# EAGLE design pcb v1 mod (EAGLE 7.3.0)
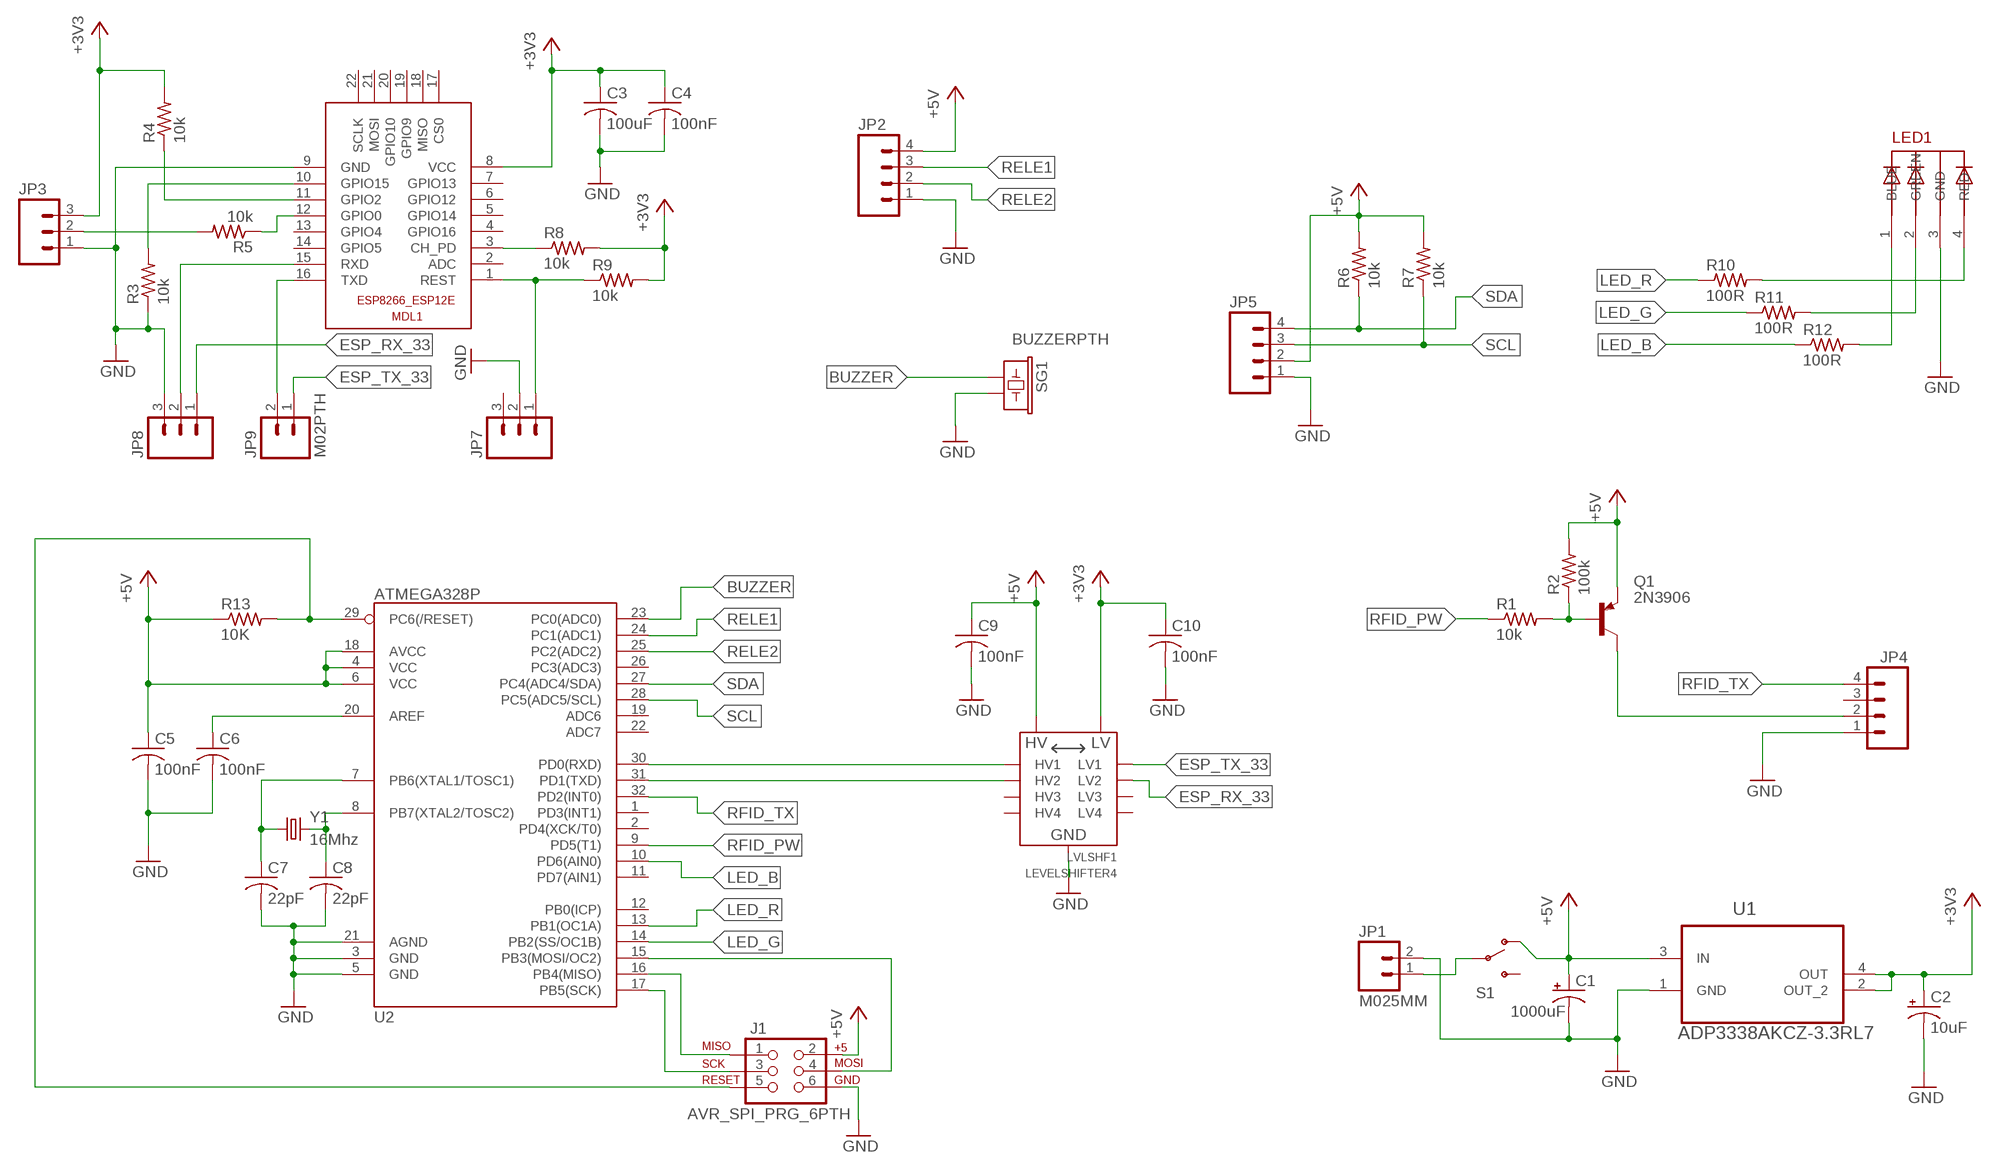
[diagram p0: schematic, sheet 1]

## Parts
C1  1000uF  CPOL-USE2.5-6  [E2,5-6]
C2  10uF  CPOL-USE2.5-6  [E2,5-6]
C3  100uF  C-USC1206  [C1206]
C4  100nF  C-USC0805  [C0805]
C5  100nF  C-USC0805  [C0805]
C6  100nF  C-USC0805  [C0805]
C7  22pF  C-USC1206  [C1206]
C8  22pF  C-USC1206  [C1206]
C9  100nF  C-USC0805  [C0805]
C10  100nF  C-USC0805  [C0805]
J1  AVR_SPI_PRG_6PTH  [2X3]
JP1  M025MM  [SCREWTERMINAL-5MM-2]
JP2  M041X04_NO_SILK  [1X04_NO_SILK]
JP3  M03PTH  [1X03]
JP4  M041X04_NO_SILK  [1X04_NO_SILK]
JP5  M041X04_NO_SILK  [1X04_NO_SILK]
JP7  M03PTH  [1X03]
JP8  M03PTH  [1X03]
JP9  M02PTH  [1X02]
LED1  5MMRGBLED  [LED5MMRGB]
LVLSHF1  LEVELSHIFTER4  [LEVELSHIFTER4]
MDL1  ESP8266-12EESP8266-ESP12E  [ESP8266-ESP12E]
Q1  2N3906  [TO92]
R1  10k  R-US_R0805  [R0805]
R2  100k  R-US_R0805  [R0805]
R3  10k  R-US_R0805  [R0805]
R4  10k  R-US_R0805  [R0805]
R5  10k  R-US_R0805  [R0805]
R6  10k  R-US_R0805  [R0805]
R7  10k  R-US_R0805  [R0805]
R8  10k  R-US_R0805  [R0805]
R9  10k  R-US_R0805  [R0805]
R10  100R  R-US_R1206  [R1206]
R11  100R  R-US_R0805  [R0805]
R12  100R  R-US_R0805  [R0805]
R13  10K  R-US_R0805  [R0805]
S1  SWITCH-SPDTPTH  [SWITCH-SPDT]
SG1  BUZZERPTH  [BUZZER-12MM]
U1  ADP3338AKCZ-3.3RL7  [SOT230P700X180-4N]
U2  ATMEGA328P  ATMEGA328_SMT  [TQFP32-08]
Y1  16Mhz  CRYSTALHC49US  [HC49US]

## Nets
+3V3: C2.+ C3.1 C4.1 C10.1 JP3.3 LVLSHF1.LV MDL1.8(VCC) R4.2 R8.2 R9.2 U1.2(OUT_2) U1.4(OUT)
+5V: C1.+ C5.1 C9.1 J1.2 JP2.4 JP5.2 LVLSHF1.HV Q1.3(E) R2.2 R6.2 R7.2 R13.1 S1.1(O) U1.3(IN) U2.4(VCC) U2.6(VCC) U2.18(AVCC)
AT_RST: J1.5 R13.2 U2.29(PC6(/RESET))
BUZZER: SG1.+ U2.23(PC0(ADC0))
ESP_RX_33: JP8.1 LVLSHF1.LV2
ESP_TX_33: JP9.1 LVLSHF1.LV1
GND: C1.- C2.- C3.2 C4.2 C5.2 C6.2 C7.2 C8.2 C9.2 C10.2 J1.6 JP1.2 JP2.1 JP3.1 JP4.1 JP5.1 JP7.2 JP8.3 LED1.3(GND) LVLSHF1.GND LVLSHF1.GND1(GND) MDL1.9(GND) R3.1 SG1.- U1.1(GND) U2.3(GND) U2.5(GND) U2.21(AGND)
LED_B: R12.1 U2.10(PD6(AIN0))
LED_G: R11.1 U2.14(PB2(SS/OC1B))
LED_R: R10.1 U2.13(PB1(OC1A))
N$1: JP1.1 S1.2(P)
N$2: MDL1.3(CH_PD) R8.1
N$3: MDL1.11(GPIO2) R4.1
N$4: MDL1.12(GPIO0) R5.1
N$5: MDL1.10(GPIO15) R3.2
N$6: JP8.2 MDL1.15(RXD)
N$7: Q1.2(B) R1.2 R2.1
N$8: JP9.2 MDL1.16(TXD)
N$9: JP7.1 MDL1.1(REST) R9.1
N$10: LED1.4(RED) R10.2
N$11: C7.1 U2.7(PB6(XTAL1/TOSC1)) Y1.1
N$12: C8.1 U2.8(PB7(XTAL2/TOSC2)) Y1.2
N$14: C6.1 U2.20(AREF)
N$15: LED1.2(GREEN) R11.2
N$16: LED1.1(BLUE) R12.2
N$17: J1.3 U2.17(PB5(SCK))
N$18: J1.1 U2.16(PB4(MISO))
N$19: J1.4 U2.15(PB3(MOSI/OC2))
N$20: JP3.2 R5.2
N$21: LVLSHF1.HV1 U2.30(PD0(RXD))
N$22: LVLSHF1.HV2 U2.31(PD1(TXD))
N$23: JP4.2 Q1.1(C)
RELE1: JP2.3 U2.24(PC1(ADC1))
RELE2: JP2.2 U2.25(PC2(ADC2))
RFID_PW: R1.1 U2.9(PD5(T1))
RFID_TX: JP4.4 U2.32(PD2(INT0))
SCL: JP5.3 R7.1 U2.28(PC5(ADC5/SCL))
SDA: JP5.4 R6.1 U2.27(PC4(ADC4/SDA))
Unconnected: JP4.3 JP7.3 LVLSHF1.HV3 LVLSHF1.HV4 LVLSHF1.LV3 LVLSHF1.LV4 MDL1.2(ADC) MDL1.4(GPIO16) MDL1.5(GPIO14) MDL1.6(GPIO12) MDL1.7(GPIO13) MDL1.13(GPIO4) MDL1.14(GPIO5) MDL1.17(CS0) MDL1.18(MISO) MDL1.19(GPIO9) MDL1.20(GPIO10) MDL1.21(MOSI) MDL1.22(SCLK) S1.3(S) U2.1(PD3(INT1)) U2.2(PD4(XCK/T0)) U2.11(PD7(AIN1)) U2.12(PB0(ICP)) U2.19(ADC6) U2.22(ADC7) U2.26(PC3(ADC3))

## Library data of the parts
C1 C2 = rcl:CPOL-US: POLARIZED CAPACITOR, American symbol
C3-C10 = rcl:C-US: CAPACITOR, American symbol
J1 = SparkFun-Connectors:AVR_SPI_PRG_6: AVR ISP 6 Pin This is the reduced ISP connector for AVR programming. Common on Arduino. This footprint will take up less PCB space and can be used with a 10-pin to 6-pin adapter such as SKU: BOB-08508 **Special note about "TEST_POINT" package. The stop mask is on the top side, so if you want your programming test points to be on the bottom of your board, make sure to place this package on the bottom side of the board. This also ensure that the orientation to program from the bottom side will be correct.
JP1 = SparkFun-Connectors:M02: Standard 2-pin 0.1" header. Use with - straight break away headers ( PRT-00116) - right angle break away headers (PRT-00553) - swiss pins (PRT-00743) - machine pins (PRT-00117) - female headers (PRT-00115) Molex polarized connector foot print use with: PRT-08233 with associated crimp pins and housings. 2.54_SCREWTERM for use with PRT-10571. 3.5mm Screw Terminal footprints for PRT-08084 5mm Screw Terminal footprints for use with PRT-08432; STOREFRONT_ID: PRT-08432
JP2 JP4 JP5 = SparkFun-Connectors:M04: Header 4 Standard 4-pin 0.1" header. Use with straight break away headers (SKU : PRT-00116), right angle break away headers (PRT-00553), swiss pins (PRT-00743), machine pins (PRT-00117), and female headers (PRT-00115). Molex polarized connector foot print use with SKU : PRT-08231 with associated crimp pins and housings. 1MM SMD Version SKU: PRT-10208
JP3 JP7 JP8 = SparkFun-Connectors:M03: Header 3 Standard 3-pin 0.1" header. Use with straight break away headers (SKU : PRT-00116), right angle break away headers (PRT-00553), swiss pins (PRT-00743), machine pins (PRT-00117), and female headers (PRT-00115). Molex polarized connector foot print use with SKU : PRT-08232 with associated crimp pins and housings.
JP9 = SparkFun-Connectors:M02: Standard 2-pin 0.1" header. Use with - straight break away headers ( PRT-00116) - right angle break away headers (PRT-00553) - swiss pins (PRT-00743) - machine pins (PRT-00117) - female headers (PRT-00115) Molex polarized connector foot print use with: PRT-08233 with associated crimp pins and housings. 2.54_SCREWTERM for use with PRT-10571. 3.5mm Screw Terminal footprints for PRT-08084 5mm Screw Terminal footprints for use with PRT-08432
LED1 = adafruit:5MMRGBLED
LVLSHF1 = partes:LEVELSHIFTER4
MDL1 = ESP8266-ESP12E:ESP8266-12E: ESP8266-12E with additional I/O and GPIO04/05 corrected The author cannot warrant that this library is free from error or will meet your specific requirements. Created by PuceBaboon.com. Komagane, Nagano, JAPAN
Q1 = transistor-pnp:2N3906: PNP Transistor
R1-R13 = rcl:R-US_: RESISTOR, American symbol
S1 = SparkFun-Electromechanical:SWITCH-SPDT: SPDT Switch Simple slide switch, Spark Fun Electronics SKU : COM-00102 DPDT SMT slide switch, AYZ0202, SWCH-08179; PROD_ID: SWCH-08261
SG1 = SparkFun-Electromechanical:BUZZER: Buzzer 12mm Spark Fun Electronics SKU : Comp-Buzzer
U1 = ADI-Phase-2:ADP3338AKCZ-3.3RL7: Low Dropout Regulator; MPN: ADP3338AKCZ-3.3RL7; OC_FARNELL: 1319313; OC_NEWARK: 19M8720; PACKAGE: SOT-223-3; SUPPLIER: Analog Devices
U2 = SparkFun-DigitalIC:ATMEGA328_SMT: 32-Pin Atmega328 part Commonly used on Arduino compatible boards Available in QFP and QFN packages TQFP is IC-09069 QFN is non-stock; PROD_ID: IC-09069
Y1 = SparkFun-FreqCtrl:CRYSTAL: Various standard crystals. Proven footprints. Spark Fun Electronics SKU : COM-00534

## Board
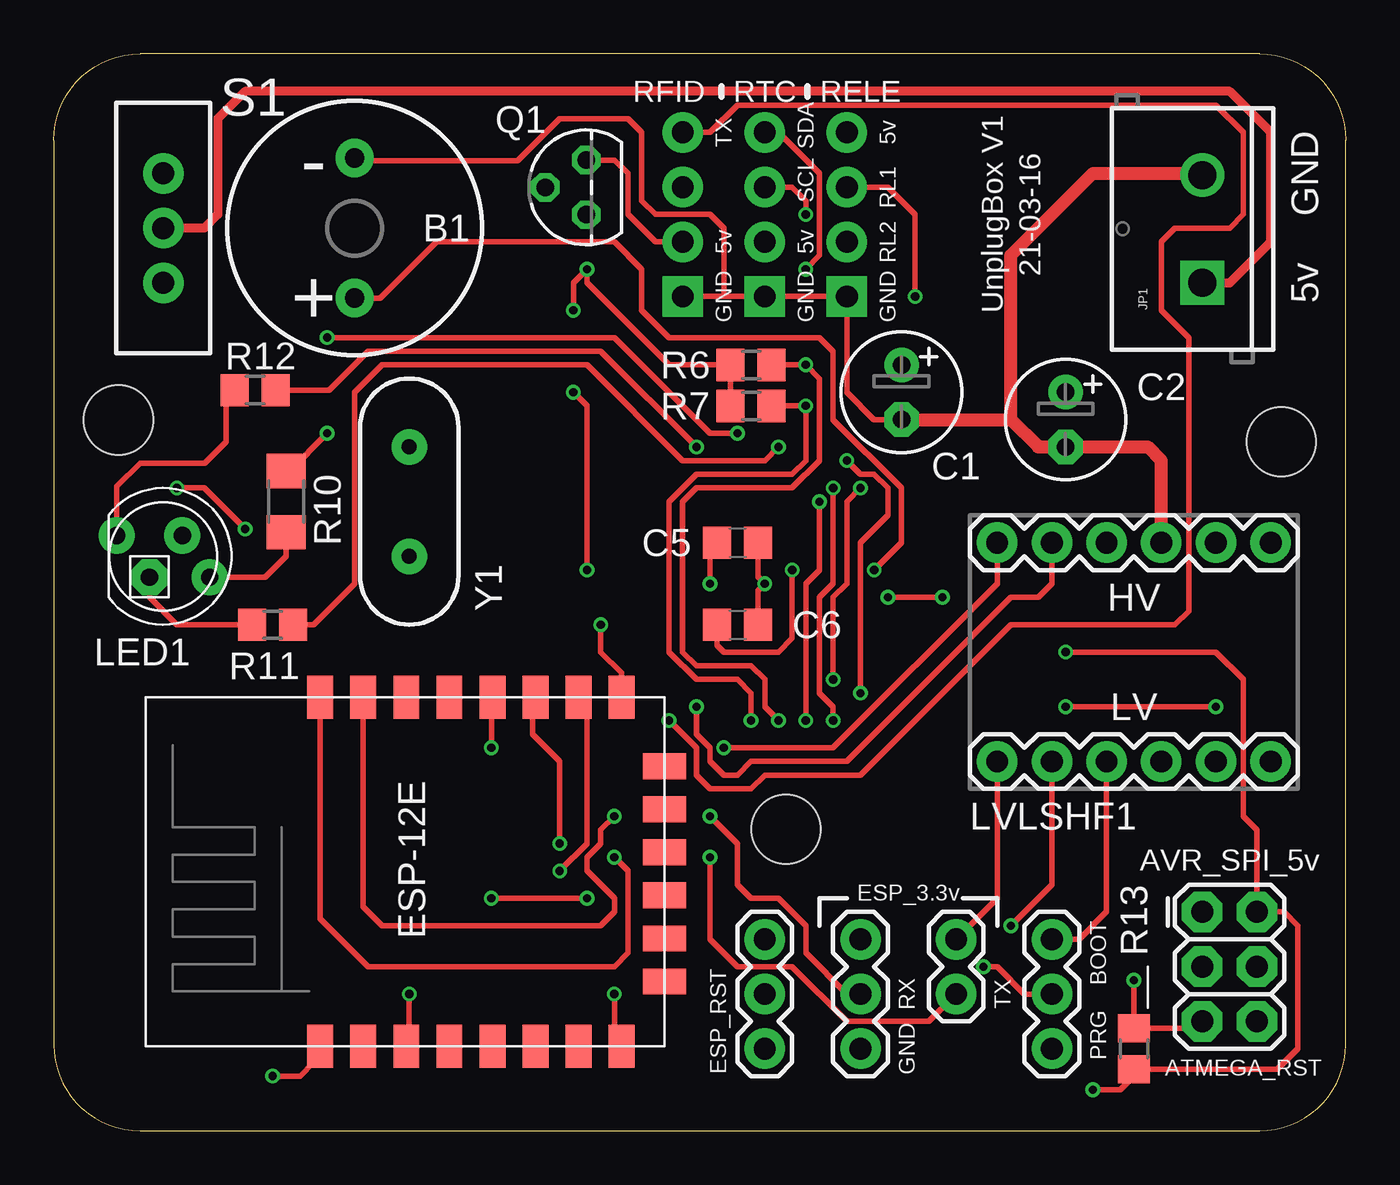
[diagram p1: board, top side]
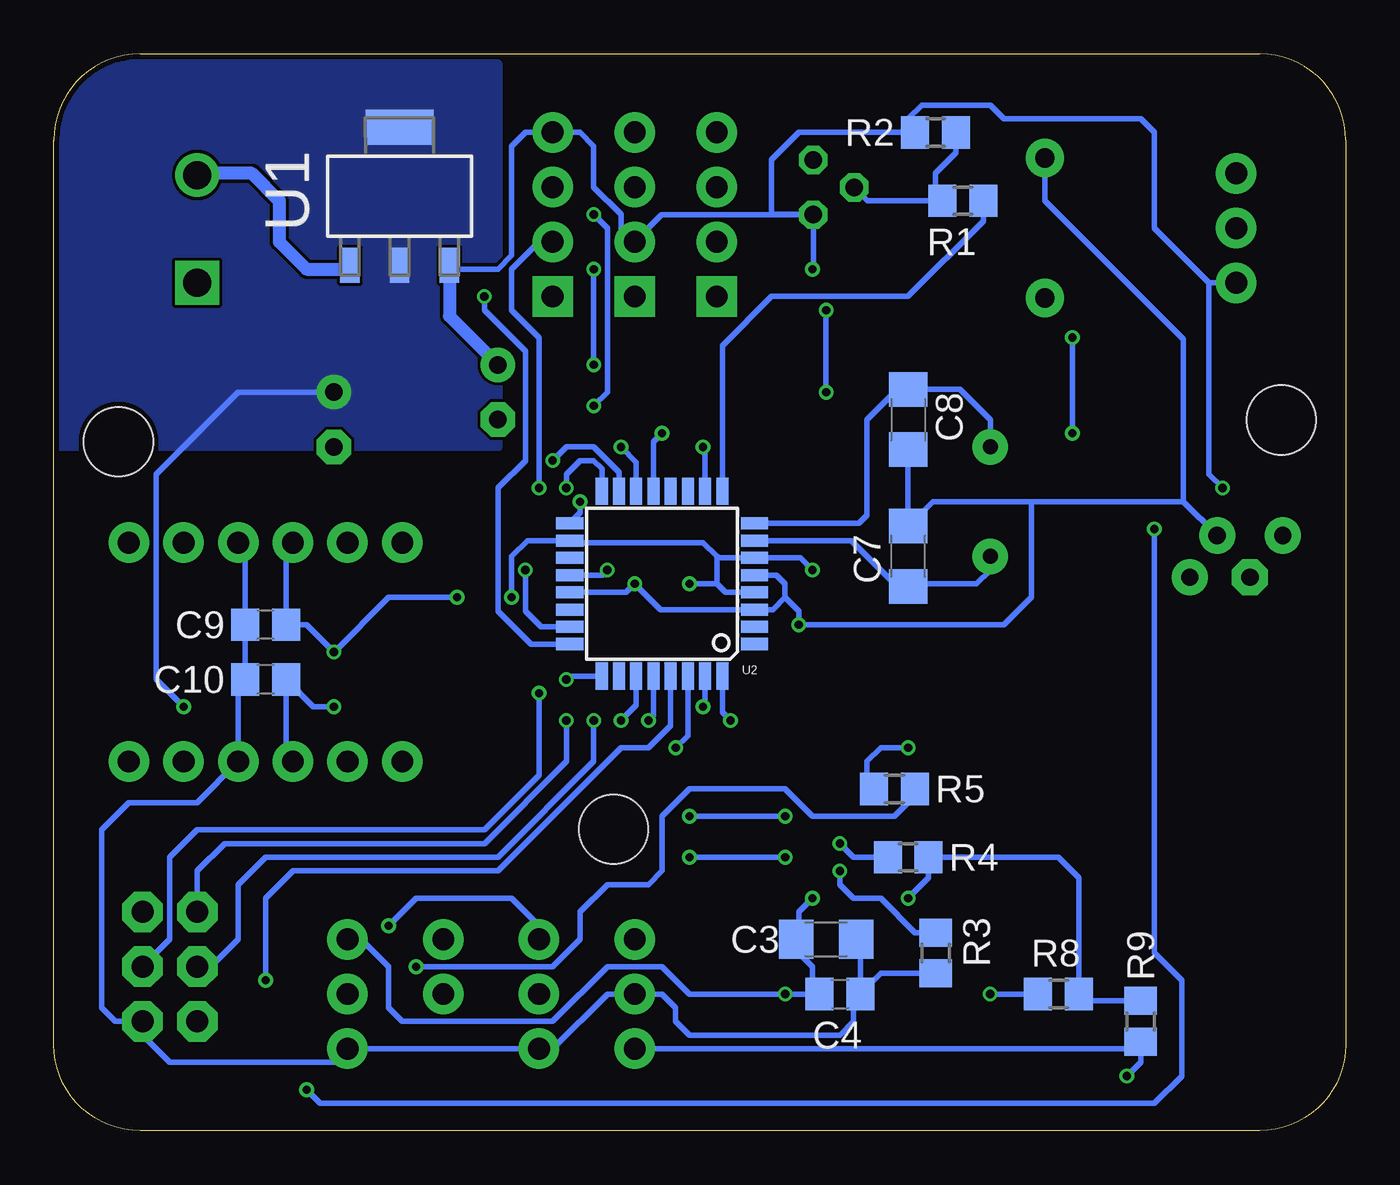
[diagram p2: board, bottom side, seen from below]

Size 60 x 50 mm. Coordinates in mm from the lower left corner, seen from the top.
Outline: 4,0 56,0 arc90 60,4 60,46 arc90 56,50 4,50 arc90 0,46 0,4 arc90 4,0
Copper layers (1*16): Top 0.035mm / dielectric 1.5mm / Bottom 0.035mm
Design rules "ITead_rule": minimum track width 6mil, minimum drill 12mil, track to track 6mil, track to pad 6mil, pad to pad 6mil, via to via 6mil, smd to smd 0mil, copper to edge 10mil, drill to drill 10mil, minimum pad ring 10mil, minimum via ring 6mil, stop-mask expansion 2mil, vias tented up to drill 100mil, thermal gap 10mil
Holes 3.2 mm at 57,32 3,33 34,14

### Footprints (pad centres in the part's own frame; a part is rotated, then mirrored left to right if it is on the bottom)
E2,5-6 = drill 0.813 pad 1.6: + -1.27,0 | drill 0.813 pad 1.6 octagon: - 1.27,0
C1206 = smd 1.6 x 1.8: 1 -1.4,0; 2 1.4,0
C0805 = smd 1.3 x 1.5: 1 -0.95,0; 2 0.95,0
2X3 = drill 1.016 pad 1.88 octagon: 1 0,0; 2 0,2.54; 3 2.54,0; 4 2.54,2.54; 5 5.08,0; 6 5.08,2.54
SCREWTERMINAL-5MM-2 = drill 1.3 pad 2.032 square: 1 0,0 | drill 1.3 pad 2.032: 2 5,0
1X04_NO_SILK = drill 1.016 pad 1.88 square: 1 0,0 | drill 1.016 pad 1.88: 2 2.54,0; 3 5.08,0; 4 7.62,0
1X03 = drill 1.016 pad 1.88: 1 0,0; 2 2.54,0; 3 5.08,0
1X02 = drill 1.016 pad 1.88: 1 0,0; 2 2.54,0
LED5MMRGB = drill 0.8 pad 1.676: 1 -2.159,0.968; 3 0.889,0.968; 4 2.159,-0.968 | drill 0.8 pad 1.676 octagon: 2 -0.635,-0.968
LEVELSHIFTER4 = drill 1.016 pad 1.88: GND 8.89,1.27; GND1 8.89,11.43; HV 6.35,11.43; HV1 1.27,11.43; HV2 3.81,11.43; HV3 11.43,11.43; HV4 13.97,11.43; LV 6.35,1.27; LV1 1.27,1.27; LV2 3.81,1.27; LV3 11.43,1.27; LV4 13.97,1.27
ESP8266-ESP12E = smd 2 x 1.2: 1 0,16; 2 0,14; 3 0,12; 4 0,10; 5 0,8; 6 0,6; 7 0,4; 8 0,2; 9 16.2,2; 10 16.2,4; 11 16.2,6; 12 16.2,8; 13 16.2,10; 14 16.2,12; 15 16.2,14; 16 16.2,16 | smd 1.2 x 2: 17 11,0; 18 3,0; 19 5,0; 20 13,0; 21 7,0; 22 9,0
TO92 = drill 0.813 octagon: 1 1.27,0; 2 0,1.905; 3 -1.27,0
R0805 = smd 1.3 x 1.5: 1 -0.95,0; 2 0.95,0
R1206 = smd 1.6 x 1.803: 1 -1.422,0; 2 1.422,0
SWITCH-SPDT = drill 1.016 pad 1.88: 1 0,2.54; 2 0,0; 3 0,-2.54
BUZZER-12MM = drill 0.9 pad 1.778: + 3.25,0; - -3.25,0
SOT230P700X180-4N = smd 1.626 x 0.889: 1 -3.2,2.311; 2 -3.2,0; 3 -3.2,-2.311 | smd 1.626 x 3.175: 4 3.2,0
TQFP32-08 = smd 1.27 x 0.559: 1 -4.293,2.8; 2 -4.293,2; 3 -4.293,1.2; 4 -4.293,0.4; 5 -4.293,-0.4; 6 -4.293,-1.2; 7 -4.293,-2; 8 -4.293,-2.8; 17 4.293,-2.8; 18 4.293,-2; 19 4.293,-1.2; 20 4.293,-0.4; 21 4.293,0.4; 22 4.293,1.2; 23 4.293,2; 24 4.293,2.8 | smd 0.559 x 1.27: 9 -2.8,-4.293; 10 -2,-4.293; 11 -1.2,-4.293; 12 -0.4,-4.293; 13 0.4,-4.293; 14 1.2,-4.293; 15 2,-4.293; 16 2.8,-4.293; 25 2.8,4.293; 26 2,4.293; 27 1.2,4.293; 28 0.4,4.293; 29 -0.4,4.293; 30 -1.2,4.293; 31 -2,4.293; 32 -2.8,4.293
HC49US = drill 0.7 pad 1.651: 1 -2.54,0; 2 2.54,0

### Placement (x,y rotation side)
C1  39.37,34.29 270 top
C2  46.99,33.02 270 top
C3  24.13,8.89 0 bottom
C4  23.5,6.35 0 bottom
C5  31.75,27.3 0 top
C6  31.75,23.5 0 top
C7  20.32,26.67 90 bottom
C8  20.32,33.02 270 bottom
C9  50.16,23.5 180 bottom
C10  50.16,20.95 180 bottom
J1  53.34,10.16 270 top
JP1  53.34,39.37 90 top
JP2  36.83,38.73 90 top
JP3  46.35,3.81 90 top
JP4  29.21,38.73 90 top
JP5  33.02,38.73 90 top
JP7  33.02,3.81 90 top
JP8  37.47,8.89 270 top
JP9  41.91,8.89 270 top
LED1  5.08,26.67 0 top
LVLSHF1  42.55,15.88 0 top
MDL1  28.37,3.93 90 top
Q1  24.73,43.8 90 top
R1  17.78,43.18 180 bottom
R2  19.05,46.35 180 bottom
R3  19.05,8.26 90 bottom
R4  20.32,12.7 0 bottom
R5  20.95,15.88 0 bottom
R6  32.38,35.56 180 top
R7  32.38,33.66 180 top
R8  13.34,6.35 0 bottom
R9  9.53,5.08 90 bottom
R10  10.79,29.21 270 top
R11  10.16,23.5 180 top
R12  9.35,34.38 180 top
R13  50.16,3.81 90 top
S1  5.08,41.91 180 top
SG1  13.97,41.91 270 top
U1  43.94,43.38 90 bottom
U2  31.75,25.4 180 bottom
Y1  16.51,29.21 90 top

### Tracks (layer width: path | path; a pad name or v marks a point on that pad's centre or on a via)
+3V3  (via drill 0.38)
  Top 0.254: v26.04,6.35 26.04,4.27 MDL1.8 | v20.32,10.79 v24.77,10.79 | JP3.3 47.62,8.89 48.9,10.16 LVLSHF1.LV | v53.98,19.68 v46.99,19.68
  Bottom 0.254: R9.2 12.06,6.03 R8.2 12.38,11.75 13.34,12.7 R4.2 19.37,11.74 v20.32,10.79 | v24.77,10.79 25.4,10.16 25.4,9.02 C3.1 25.53,8.38 24.77,7.62 24.77,6.67 C4.1 v26.04,6.35 30.48,6.35 31.75,7.62 34.29,7.62 36.83,5.08 43.81,5.08 44.45,5.71 44.45,7.62 45.72,8.89 JP3.3 | LVLSHF1.LV 49.22,17.46 C10.1 47.95,19.68 v46.99,19.68 | C2.+ 51.44,34.29 55.24,30.48 55.24,20.95 v53.98,19.68
  pour Bottom (no thermals): 39.37,49.53 39.37,31.75 59.69,31.75 59.69,49.53
+5V  (via drill 0.38)
  Top 0.254: C5.1 31.11,26.99 30.48,26.67 v30.48,25.4 | v46.99,22.23 53.98,22.23 55.24,20.95 55.24,14.61 55.88,13.97 J1.2 57.15,10.16 57.78,9.53 57.78,3.81 56.84,2.86 R13.1 | R7.2 R6.2 28.57,35.56 24.77,39.37 v24.77,40.01 24.13,39.37 v24.13,38.1 | v24.77,26.04 24.77,33.66 v24.13,34.29 | v38.73,24.77 v41.27,24.77 | v5.71,29.84 6.99,29.84 v8.89,27.94 | v48.26,1.91 49.53,1.91 50.16,2.54
  Bottom 0.254: Q1.3 24.74,42.55 26.67,42.55 26.67,45.09 25.4,46.35 R2.2 20.32,46.67 20.32,46.99 19.68,47.62 16.51,47.62 15.88,46.99 9.53,46.99 8.89,46.35 8.89,41.91 6.35,39.37 | Q1.3 31.77,42.53 JP5.2 33.66,41.91 33.66,42.55 34.92,43.81 34.92,45.72 35.56,46.35 JP2.4 38.1,46.35 38.73,45.72 38.73,40.64 39.37,40.01 41.45,40.01 U1.3 | v30.48,25.4 29.21,25.4 | U2.4 28.81,25 29.21,25.4 | 29.21,26.67 29.21,25.4 | 29.21,26.67 29.84,27.3 35.95,27.3 U2.18 38.01,27.4 38.73,26.67 v38.73,24.77 | LVLSHF1.HV 49.22,26.98 C9.1 48.26,23.5 v46.99,22.23 44.45,24.77 v41.27,24.77 | v24.77,40.01 24.73,40.04 Q1.3 | v24.77,26.04 25.33,26.6 U2.6 29.14,26.6 29.21,26.67 | v24.13,34.29 v24.13,38.1 | 6.35,39.37 6.35,30.48 v5.71,29.84 | v8.89,27.94 8.89,8.26 7.62,6.99 7.62,2.54 8.89,1.27 47.62,1.27 v48.26,1.91 | 6.35,39.37 S1.1
  Bottom 0.61: U1.3 41.63,37.82 C1.+
AT_RST  (via drill 0.38)
  Top 0.254: J1.5 53.02,4.76 R13.2 v50.16,6.99
  Bottom 0.254: v50.16,6.99 50.16,10.79 48.9,12.06 39.37,12.06 33.66,17.78 32.38,17.78 31.35,18.82 U2.29
BUZZER  (via drill 0.38)
  Top 0.254: SG1.+ 15.16,38.66 17.78,41.27 26.04,41.27 27.3,40.01 27.3,38.1 28.57,36.83 35.56,36.83 36.2,36.2 36.2,33.02 39.37,29.84 39.37,27.3 v38.1,26.04
  Bottom 0.254: U2.23 37.37,23.4 38.1,24.13 v38.1,26.04
ESP_RX_33  (via drill 0.38)
  Top 0.254: LVLSHF1.LV2 46.35,11.43 v44.45,9.53
  Bottom 0.254: v44.45,9.53 43.18,10.79 38.73,10.79 37.47,9.53 JP8.1
ESP_TX_33
  Top 0.254: JP9.1 43.81,10.79 LVLSHF1.LV1
GND  (via drill 0.38)
  Top 0.254: 31.11,38.73 JP5.1 JP2.1 36.83,34.29 38.1,33.02 C1.- | 31.11,38.73 31.11,41.91 30.48,42.55 27.94,42.55 27.3,43.18 27.3,46.35 26.67,46.99 23.5,46.99 21.54,45.03 14.1,45.03 SG1.- | C5.2 32.7,25.72 v33.02,25.4 32.7,25.08 C6.2 | MDL1.9 26.37,21.25 25.4,22.23 v25.4,23.5 | JP4.1 31.11,38.73
  Top 0.61: C1.- 44.45,33.02 | 44.45,33.02 45.72,31.75 C2.- 50.8,31.75 51.44,31.11 LVLSHF1.GND1 | 44.45,33.02 44.45,40.64 48.26,44.45 53.26,44.45 JP1.2
  Bottom 0.254: C8.2 C7.2 19.18,29.21 14.61,29.21 | U2.21 33.42,25 v33.02,25.4 31.82,24.2 U2.3 26.6,24.2 26.04,24.77 | 26.04,24.77 26.04,25.4 26.43,25.8 U2.5 | C4.2 22.55,8.71 C3.2 | R3.1 21.59,7.3 C4.2 | C4.2 22.86,6.04 22.86,5.08 23.5,4.45 30.48,4.45 31.11,5.08 31.11,5.71 31.75,6.35 JP7.2 34.29,6.35 36.83,3.81 JP8.3 JP3.1 46.99,3.17 54.61,3.17 55.88,4.45 J1.6 57.15,5.08 57.78,5.71 57.78,13.97 56.52,15.24 53.34,15.24 LVLSHF1.GND 51.44,20.64 C10.2 C9.2 51.12,26.98 LVLSHF1.GND1 | 26.04,24.77 25.4,24.13 v25.4,23.5 15.88,23.5 14.61,24.77 14.61,29.21 | 7.54,29.21 14.61,29.21 | 7.54,29.21 7.54,36.75 13.97,43.18 SG1.- | 7.54,29.21 LED1.3
  Bottom 0.61: U1.1 46.43,40.01 48.26,40.01 49.53,41.27 49.53,43.18 50.8,44.45 53.26,44.45 JP1.2
LED_B  (via drill 0.38)
  Top 0.254: R12.1 12.79,34.38 14.61,36.2 25.4,36.2 v29.84,31.75
  Bottom 0.254: U2.10 29.75,31.66 v29.84,31.75
LED_G  (via drill 0.38)
  Top 0.254: R11.1 12.06,23.5 13.97,25.4 13.97,34.29 15.24,35.56 24.77,35.56 29.21,31.11 33.02,31.11 v33.66,31.75
  Bottom 0.254: U2.14 32.95,31.05 v33.66,31.75
LED_R  (via drill 0.38)
  Top 0.254: R10.1 10.95,30.63 v12.7,32.38 | v12.7,36.83 26.04,36.83 30.48,32.38 v31.75,32.38
  Bottom 0.254: v12.7,32.38 v12.7,36.83 | U2.13 32.15,31.98 v31.75,32.38
N$1
  Top 0.406: JP1.1 54.61,39.37 56.52,41.27 56.52,46.35 54.61,48.26 8.89,48.26 7.62,46.99 7.62,42.55 6.99,41.91 S1.2
N$2  (via drill 0.38)
  Top 0.254: v16.51,6.35 16.51,4.07 MDL1.3
  Bottom 0.254: R8.1 v16.51,6.35
N$3  (via drill 0.38)
  Top 0.254: v23.5,13.34 23.5,17.14 22.23,18.41 22.23,19.98 MDL1.11
  Bottom 0.254: R4.1 22.86,12.7 v23.5,13.34
N$4  (via drill 0.38)
  Top 0.254: v20.32,17.78 20.32,20.08 MDL1.12
  Bottom 0.254: v20.32,17.78 21.59,17.78 22.23,17.14 22.23,16.2 R5.1
N$5  (via drill 0.38)
  Top 0.254: v23.5,12.06 24.77,13.34 24.77,19.74 MDL1.10
  Bottom 0.254: R3.2 20,9.21 21.59,10.79 22.86,10.79 23.5,11.43 v23.5,12.06
N$6  (via drill 0.38)
  Top 0.254: MDL1.15 14.37,10.39 15.24,9.53 25.4,9.53 26.04,10.16 26.04,10.79 24.77,12.06 24.77,12.7 25.4,13.34 25.4,13.97 v26.04,14.61 | v30.48,14.61 31.75,13.34 31.75,11.43 32.38,10.79 33.66,10.79 34.92,9.53 34.92,8.26 36.83,6.35 JP8.2
  Bottom 0.254: v26.04,14.61 v30.48,14.61
N$7
  Bottom 0.254: R2.1 18.1,45.4 19.05,44.45 19.05,43.5 R1.2 22.2,43.18 Q1.2
N$8  (via drill 0.38)
  Top 0.254: MDL1.16 12.37,9.85 14.61,7.62 26.04,7.62 26.67,8.26 26.67,12.06 v26.04,12.7 | v30.48,12.7 30.48,8.89 31.75,7.62 34.29,7.62 36.83,5.08 40.64,5.08 JP9.2
  Bottom 0.254: v26.04,12.7 v30.48,12.7
N$9  (via drill 0.38)
  Top 0.254: v10.16,2.54 11.43,2.54 12.06,3.17 12.06,3.62 MDL1.1
  Bottom 0.254: v10.16,2.54 9.53,3.17 R9.1 9.85,3.81 JP7.1
N$10
  Top 0.254: LED1.4 9.83,25.7 10.79,26.67 R10.2
N$11
  Bottom 0.254: Y1.1 16.51,26.04 17.14,25.4 20.19,25.4 C7.1 20.45,25.4 20.95,25.4 22.95,27.4 U2.7
N$12
  Bottom 0.254: Y1.2 16.51,33.02 17.91,34.42 C8.1 20.45,34.29 20.95,34.29 22.23,33.02 22.23,28.57 22.6,28.2 U2.8
N$14  (via drill 0.38)
  Top 0.254: v34.29,26.04 34.29,22.86 33.66,22.23 31.11,22.23 30.8,22.54 C6.1
  Bottom 0.254: v34.29,26.04 34.52,25.8 U2.20
N$15
  Top 0.254: LED1.2 4.45,24.77 5.71,23.5 R11.2
N$16
  Top 0.254: LED1.1 2.92,29.92 4,31 7,31 8,32 8,34 R12.2
N$17  (via drill 0.38)
  Top 0.254: v34.92,19.05 34.92,25.4 35.56,26.04 v35.56,29.21
  Bottom 0.254: J1.3 52.7,7.62 51.44,8.89 51.44,11.43 50.16,12.7 39.37,12.7 34.92,17.14 v34.92,19.05 | v35.56,29.21 35.56,28.68 U2.17
N$18  (via drill 0.38)
  Top 0.254: v36.2,19.05 36.2,19.68 35.56,20.32 35.56,24.77 36.2,25.4 v36.2,29.84
  Bottom 0.254: J1.1 53.34,12.06 52.07,13.34 40.01,13.34 36.2,17.14 v36.2,19.05 | U2.16 34.55,30.74 34.92,31.11 35.56,31.11 36.2,30.48 v36.2,29.84
N$19  (via drill 0.38)
  Top 0.254: v37.47,20.32 37.47,27.3 38.73,28.57 38.73,29.84 38.1,30.48 37.47,30.48 v36.83,31.11
  Bottom 0.254: J1.4 54.61,8.89 54.61,12.7 53.34,13.97 40.01,13.97 37.47,16.51 v37.47,20.32 | U2.15 33.75,30.57 34.92,31.75 36.2,31.75 v36.83,31.11
N$20  (via drill 0.38)
  Top 0.254: v43.18,7.62 43.81,7.62 45.09,6.35 JP3.2
  Bottom 0.254: R5.2 20,15.55 20.95,14.61 24.77,14.61 26.04,15.88 30.48,15.88 31.75,14.61 31.75,12.06 32.38,11.43 34.29,11.43 35.56,10.16 35.56,8.89 36.83,7.62 v43.18,7.62
N$21  (via drill 0.38)
  Top 0.254: v31.11,17.78 36.2,17.78 43.81,25.4 LVLSHF1.HV1
  Bottom 0.254: U2.30 30.55,18.34 v31.11,17.78
N$22  (via drill 0.38)
  Top 0.254: LVLSHF1.HV2 46.35,25.4 45.72,24.77 44.45,24.77 36.83,17.14 32.38,17.14 31.75,16.51 31.11,16.51 30.48,17.14 30.48,17.78 29.84,18.41 v29.84,19.68
  Bottom 0.254: U2.31 29.75,19.78 v29.84,19.68
N$23
  Top 0.254: Q1.1 26.05,45.07 26.67,44.45 26.67,42.55 27.94,41.27 JP4.2
RELE1  (via drill 0.38)
  Top 0.254: JP2.3 38.73,43.81 40.01,42.55 v40.01,38.73
  Bottom 0.254: v40.01,38.73 40.01,38.1 38.1,36.2 38.1,31.11 39.37,29.84 39.37,24.13 37.84,22.6 U2.24
RELE2  (via drill 0.38)
  Top 0.254: v36.2,20.95 36.2,24.77 36.83,25.4 36.83,29.21 v37.47,29.84
  Bottom 0.254: JP2.2 37.47,41.27 38.73,40.01 38.73,38.1 37.47,36.83 v37.47,29.84 | U2.25 36.04,21.11 v36.2,20.95
RFID_PW
  Bottom 0.254: R1.1 16.83,42.23 20.32,38.73 26.67,38.73 28.95,36.45 U2.9
RFID_TX  (via drill 0.38)
  Top 0.254: v28.57,19.05 29.84,17.78 29.84,16.51 30.48,15.88 32.38,15.88 33.02,16.51 37.47,16.51 44.45,23.5 52.07,23.5 52.7,24.13 52.7,36.83 51.44,38.1 51.44,41.27 52.07,41.91 54.61,41.91 55.24,42.55 55.24,46.35 53.98,47.62 31.75,47.62 30.48,46.35 JP4.4
  Bottom 0.254: U2.32 28.95,19.43 v28.57,19.05
SCL  (via drill 0.38)
  Top 0.254: JP5.3 34.29,43.81 34.92,43.18 v34.92,42.55 | R7.1 v34.92,33.66 34.92,31.11 34.29,30.48 29.84,30.48 28.57,29.21 28.57,22.23 29.84,20.95 31.75,20.95 32.38,20.32 v32.38,19.05
  Bottom 0.254: v34.92,42.55 34.29,41.91 34.29,34.29 v34.92,33.66 | U2.28 32.15,19.29 v32.38,19.05
SDA  (via drill 0.38)
  Top 0.254: JP5.4 33.66,46.35 35.56,44.45 35.56,40.64 v34.92,40.01 | R6.1 v34.92,35.56 35.56,34.92 35.56,31.11 34.29,29.84 29.84,29.84 29.21,29.21 29.21,22.23 29.84,21.59 32.38,21.59 33.02,20.95 33.02,19.68 v33.66,19.05
  Bottom 0.254: v34.92,40.01 v34.92,35.56 | U2.27 32.95,19.75 v33.66,19.05

### Text on the board
tPlace: RFID | RTC | RELE | SDA | TX | 5v | - | SCL | RL1 | GND | UnplugBox V1 / 21-03-16 | B1 | 5v | 5v | RL2 | + | GND | GND | GND | 5v | AVR_SPI_5v | ESP_3.3v | BOOT | RX | TX | ESP_RST | GND | PRG | ATMEGA_RST